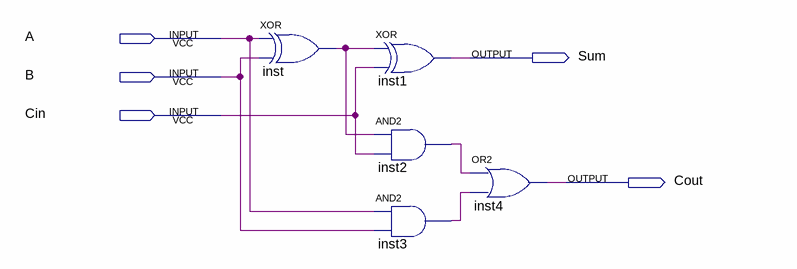
[diagram p0: schematic sheet]
// Quartus schematic fulladder_1bit.bdf as structural Verilog: 5 symbols, 5 pins
module fulladder_1bit (
  input  A,
  input  B,
  input  Cin,
  output Sum,
  output Cout
);

  wire inst2_out, inst3_out, inst_out;

  xor inst (inst_out, A, B);
  xor inst1 (Sum, inst_out, Cin);
  and inst2 (inst2_out, inst_out, Cin);
  and inst3 (inst3_out, A, B);
  or inst4 (Cout, inst2_out, inst3_out);
endmodule
